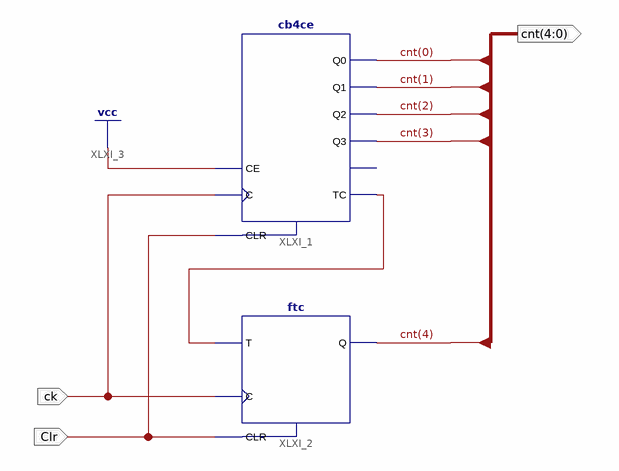
[diagram p0: schematic sheet 1]
// Xilinx ISE schematic cb5c.sch (spartan6) as structural Verilog: 2 symbols, 3 ports
module cb5c (
  input  ck,
  input  Clr,
  output [4:0] cnt
);

  wire XLXN_3;

  cb4ce XLXI_1 (
    .C(ck), .CE(1'b1), .CLR(Clr), .Q0(cnt[0]), .Q1(cnt[1]), .Q2(cnt[2]), .Q3(cnt[3]), .TC(XLXN_3));  // open: CEO
  ftc XLXI_2 (.C(ck), .CLR(Clr), .T(XLXN_3), .Q(cnt[4]));
endmodule
